# EAGLE design Calentador con PID (EAGLE 7.7.0)
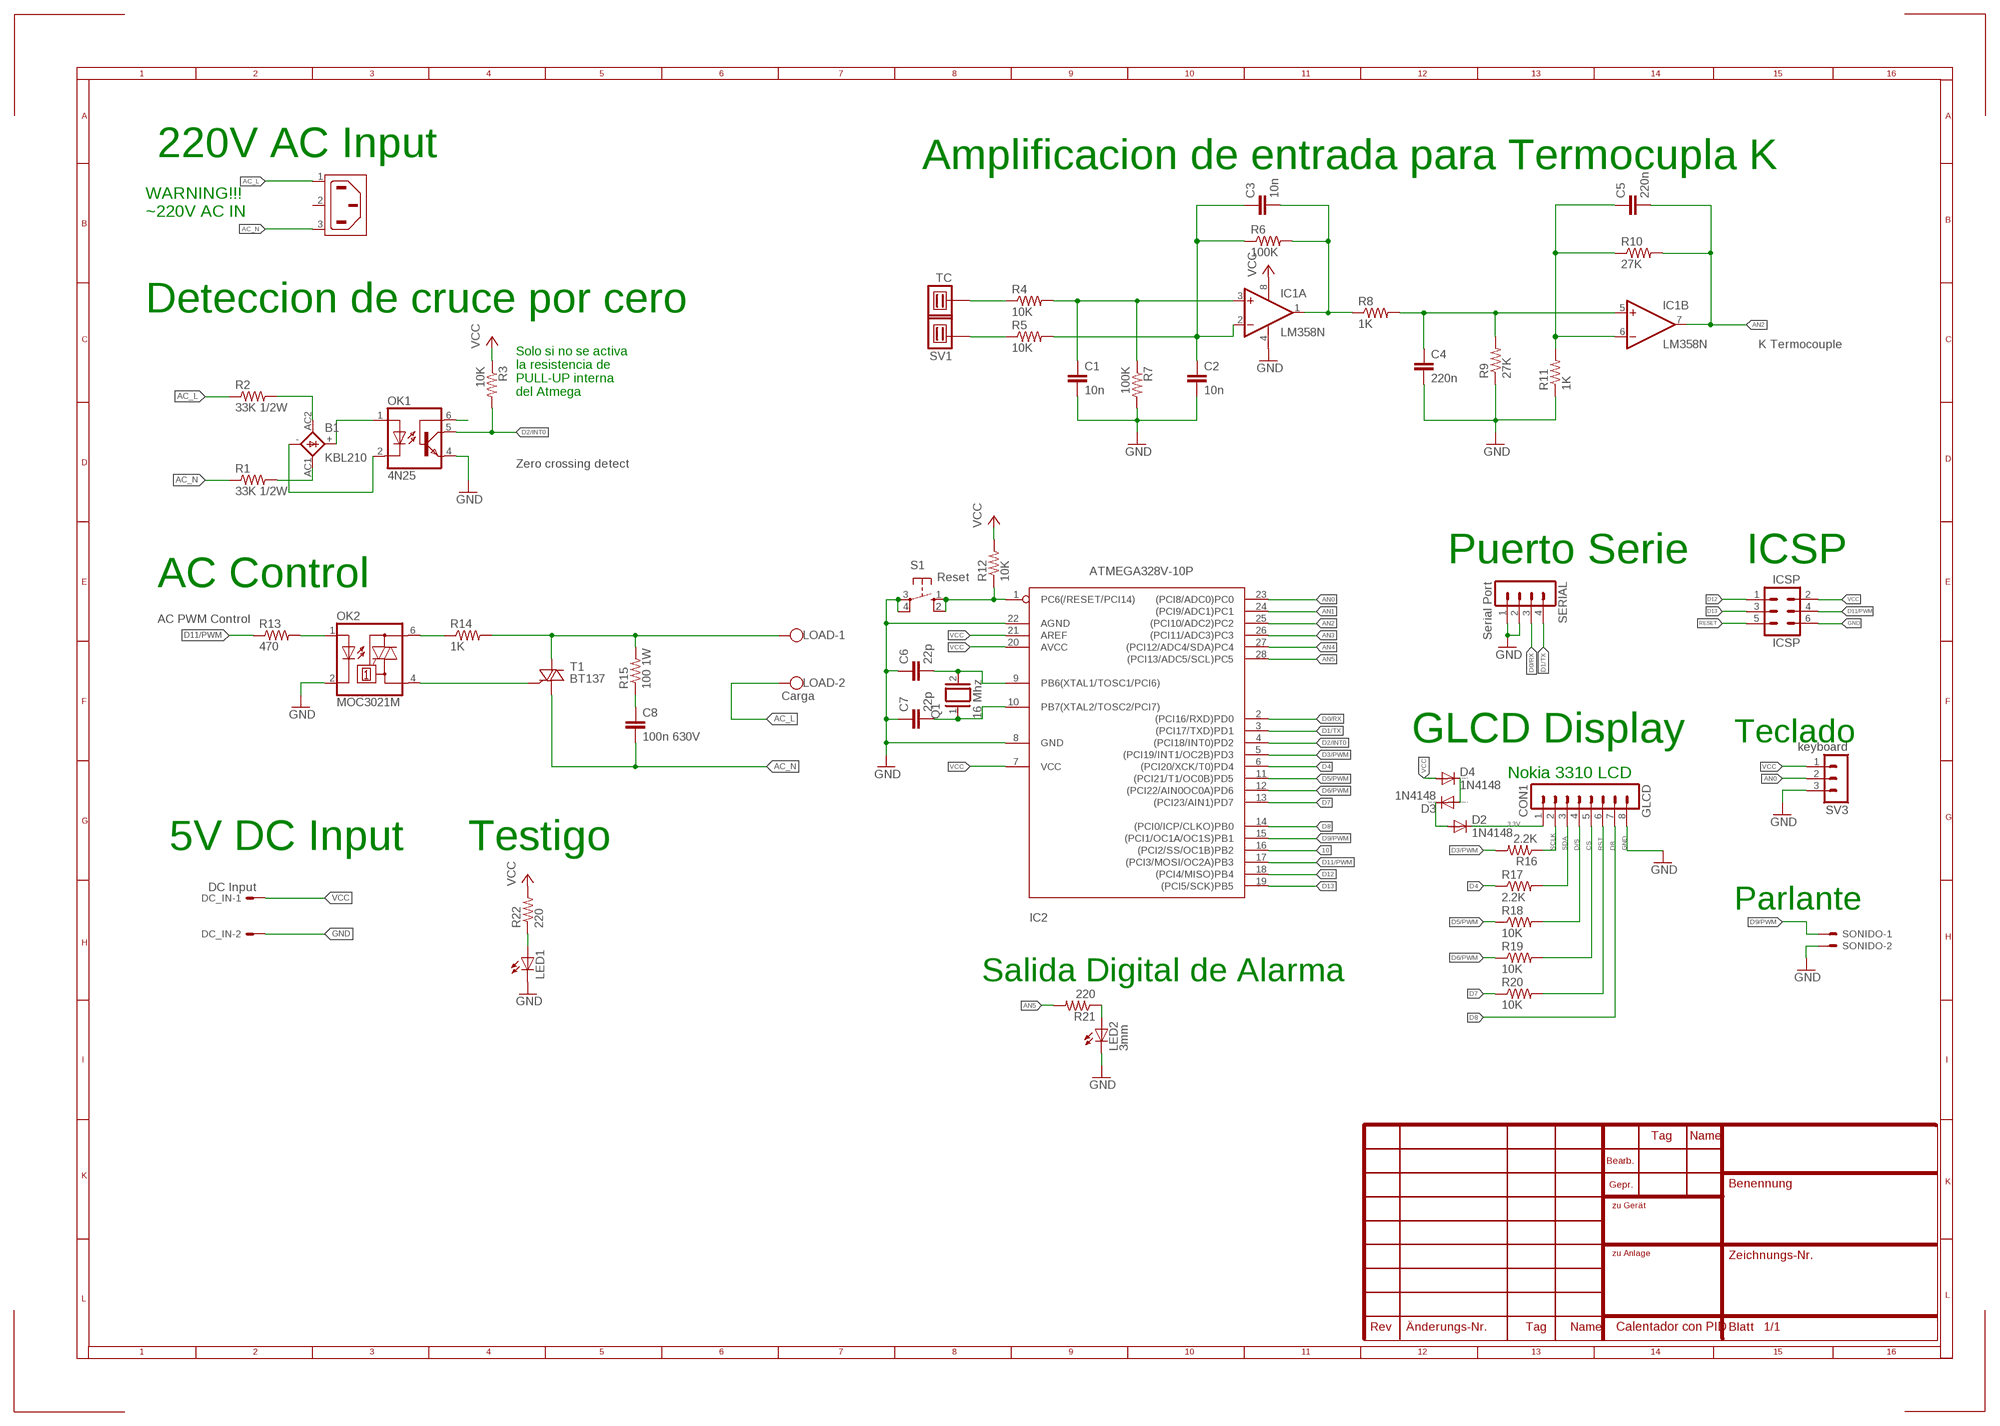
[diagram p0: schematic, sheet 1]

## Parts
B1  KBL210  KBL  [KBL]
C1  10n  C-EU050-024X044  [C050-024X044]
C2  10n  C-EU050-024X044  [C050-024X044]
C3  10n  C-EU050-024X044  [C050-024X044]
C4  220n  C-EU050-025X075  [C050-025X075]
C5  220n  C-EU050-025X075  [C050-025X075]
C6  22p  C-EU050-025X075  [C050-025X075]
C7  22p  C-EU050-025X075  [C050-025X075]
C8  100n 630V  C-EU102-043X133  [C102-043X133]
D2  1N4148  1N4148DO35-7  [DO35-7]
D3  1N4148  1N4148DO35-7  [DO35-7]
D4  1N4148  1N4148DO35-7  [DO35-7]
DC_IN  DC Input  22-23-2021  [22-23-2021]
GLCD  CON1  MA08-1  [MA08-1]
IC1  LM358N  [DIL08]
IC2  ATMEGA328V-10P  [DIL28-3]
ICSP  ICSP  MA03-2  [MA03-2]
LED1  LED3MM  [LED3MM]
LED2  3mm  LEDB155  [Q62902-B155]
LOAD  Carga  W237-102  [W237-102]
OK1  4N25  4N35  [DIL06]
OK2  MOC3021M  [DIL06]
Q1  16 Mhz  XTAL/S  [QS]
R1  33K 1/2W  R-US_0207/2V  [0207/2V]
R2  33K 1/2W  R-US_0207/2V  [0207/2V]
R3  10K  R-US_0207/7  [0207/7]
R4  10K  R-US_0207/7  [0207/7]
R5  10K  R-US_0207/7  [0207/7]
R6  100K  R-US_0207/2V  [0207/2V]
R7  100K  R-US_0207/7  [0207/7]
R8  1K  R-US_0207/2V  [0207/2V]
R9  27K  R-US_0207/7  [0207/7]
R10  27K  R-US_0207/2V  [0207/2V]
R11  1K  R-US_0207/7  [0207/7]
R12  10K  R-US_0207/15  [0207/15]
R13  470  R-US_0207/10  [0207/10]
R14  1K  R-US_0207/2V  [0207/2V]
R15  100 1W  R-US_0207/2V  [0207/2V]
R16  2.2K  R-US_0207/10  [0207/10]
R17  2.2K  R-US_0207/10  [0207/10]
R18  10K  R-US_0207/7  [0207/7]
R19  10K  R-US_0207/7  [0207/7]
R20  10K  R-US_0207/7  [0207/7]
R21  220  R-US_0207/7  [0207/7]
R22  220  R-US_0207/2V  [0207/2V]
S1  Reset  10-XX  [B3F-10XX]
SERIAL  Serial Port  MA04-1  [MA04-1]
SONIDO  22-23-2021  [22-23-2021]
SV1  TC  THERMOCOUPLE  [THERMOCOUPLE]
SV3  keyboard  MA03-1  [MA03-1]
T1  BT137  BT138-V  [TO220BV]
X1  6ESRM-P  [6ESRM-P]

## Nets
3.3V: D2.C GLCD.1
10: IC2.16((PCI2/SS/OC1B)PB2)
AC_L: LOAD.2 R2.1 X1.1(AC1)
AC_N: C8.2 R1.1 T1.T1(A1) X1.3(AC2)
AN0: IC2.23((PCI8/ADC0)PC0) SV3.2
AN1: IC2.24((PCI9/ADC1)PC1)
AN2: C5.2 IC1.7(B:OUT) IC2.25((PCI10/ADC2)PC2) R10.2
AN3: IC2.26((PCI11/ADC3)PC3)
AN4: IC2.27((PCI12/ADC4/SDA)PC4)
AN5: IC2.28((PCI13/ADC5/SCL)PC5) R21.2
CS: GLCD.5 R19.2
D0/RX: IC2.2((PCI16/RXD)PD0) SERIAL.3
D1/TX: IC2.3((PCI17/TXD)PD1) SERIAL.4
D2/INT0: IC2.4((PCI18/INT0)PD2) OK1.5(COL) R3.2
D3/PWM: IC2.5((PCI19/INT1/OC2B)PD3) R16.2
D4: IC2.6((PCI20/XCK/T0)PD4) R17.1
D5/PWM: IC2.11((PCI21/T1/OC0B)PD5) R18.1
D6/PWM: IC2.12((PCI22/AIN0OC0A)PD6) R19.1
D7: IC2.13((PCI23/AIN1)PD7) R20.1
D8: GLCD.7 IC2.14((PCI0/ICP/CLKO)PB0)
D9/PWM: IC2.15((PCI1/OC1A/OC1S)PB1) SONIDO.1
D11/PWM: IC2.17((PCI3/MOSI/OC2A)PB3) ICSP.4 R13.1
D12: IC2.18((PCI4/MISO)PB4) ICSP.1
D13: IC2.19((PCI5/SCK)PB5) ICSP.3
D/S: GLCD.4 R18.2
GND: C1.2 C2.2 C4.2 C6.1 C7.1 DC_IN.2 GLCD.8 IC1.4(P:V-) IC2.8(GND) IC2.22(AGND) ICSP.6 LED1.K(C) LED2.K(C) OK1.4(EMI) OK2.2(C) R7.2 R9.1 R11.1 S1.3(P) S1.4(P1) SERIAL.1 SERIAL.2 SONIDO.2 SV3.3
N$1: OK2.1(A) R13.2
N$2: OK2.6(A2) R14.1
N$3: B1.AC2(AC1) R2.2
N$4: B1.AC1(AC2) R1.2
N$5: B1.+ OK1.1(A)
N$6: B1.- OK1.2(C)
N$7: R4.1 SV1.2
N$8: C4.1 IC1.5(B:+IN) R8.2 R9.2
N$9: R5.1 SV1.1
N$10: C2.1 C3.1 IC1.2(A:-IN) R5.2 R6.1
N$11: C3.2 IC1.1(A:OUT) R6.2 R8.1
N$12: C5.1 IC1.6(B:-IN) R10.1 R11.2
N$13: C1.1 IC1.3(A:+IN) R4.2 R7.1
N$14: LOAD.1 R14.2 R15.2 T1.T2(A2)
N$15: OK2.4(A1) T1.G
N$16: C7.2 IC2.10(PB7(XTAL2/TOSC2/PCI7)) Q1.1
N$17: C6.2 IC2.9(PB6(XTAL1/TOSC1/PCI6)) Q1.2
N$19: D2.A D3.C
N$20: C8.1 R15.1
N$21: D3.A D4.C
N$23: LED2.A R21.1
N$24: LED1.A R22.1
N$27: OK1.6(BAS)
RESET: IC2.1(PC6(/RESET/PCI14)) ICSP.5 R12.1 S1.1(S) S1.2(S1)
RST: GLCD.6 R20.2
SCLK: GLCD.2 R16.1
SDA: GLCD.3 R17.2
VCC: D4.A DC_IN.1 IC1.8(P:V+) IC2.7(VCC) IC2.20(AVCC) IC2.21(AREF) ICSP.2 R3.1 R12.2 R22.2 SV3.1
Unconnected: X1.2(SH)

## Notes on the sheet
- 220V AC Input | Amplificacion de entrada para Termocupla K
- WARNING!!!
  ~220V AC IN
- Deteccion de cruce por cero
- K Termocouple
- Solo si no se activa
  la resistencia de
  PULL-UP interna
  del Atmega
- Zero crossing detect
- Puerto Serie | ICSP
- AC Control
- AC PWM Control
- GLCD Display | Teclado
- Nokia 3310 LCD
- 5V DC Input | Testigo
- Parlante
- Salida Digital de Alarma

## Library data of the parts
B1 = rectifier:KBL: DIOTEC RECTIFIER
C1-C8 = rcl2:C-EU: CAPACITOR, European symbol
D2-D4 = diode:1N4148: DIODE high speed (Philips)
DC_IN SONIDO = con-molex:22-23-2021: .100" (2.54mm) Center Header - 2 Pin; MF: MOLEX; MPN: 22-23-2021; OC_FARNELL: 1462926; OC_NEWARK: 25C3832
GLCD = con-lstb:MA08-1: PIN HEADER; OC_FARNELL: unknown; OC_NEWARK: unknown
IC1 = linear:LM358: OP AMP also LM158; LM258; LM2904 Source: http://cache.national.com/ds/LM/LM158.pdf
IC2 = atmega328:ATMEGA328*P: MICROCONTROLLER 32 kBytes FLASH 2 kBytes SRAM 1 kBytes EEPROM USART 8-channel 10 bit ADC
ICSP = con-lstb:MA03-2: PIN HEADER; OC_FARNELL: unknown; OC_NEWARK: unknown
LED1 LED2 = led:LED: LED OSRAM: - CHIPLED LG R971, LG N971, LY N971, LG Q971, LY Q971, LO R971, LY R971 LH N974, LH R974 LS Q976, LO Q976, LY Q976 LO Q996 - Hyper CHIPLED LW Q18S LB Q993, LB Q99A, LB R99A - SideLED LS A670, LO A670, LY A670, LG A670, LP A670 LB A673, LV A673, LT A673, LW A673 LH A674 LY A675 LS A676, LA A676, LO A676, LY A676, LW A676 LS A679, LY A679, LG A679 - Hyper Micro SIDELED® LS Y876, LA Y876, LO Y876, LY Y876 LT Y87S - SmartLED LW L88C, LW L88S LB L89C, LB L89S, LG L890 LS L89K, LO L89K, LY L89K LS L896, LA L896, LO L896, LY L896 - TOPLED LS T670, LO T670, LY T670, LG T670, LP T670 LSG T670, LSP T670, LSY T670, LOP T670, LYG T670 LG T671, LOG T671, LSG T671 LB T673, LV T673, LT T673, LW T673 LH T674 LS T676, LA T676, LO T676, LY T676, LB T676, LH T676, LSB T676, LW T676 LB T67C, LV T67C, LT T67C, LS T67K, LO T67K, LY T67K, LW E67C LS E67B, LA E67B, LO E67B, LY E67B, LB E67C, LV E67C, LT E67C LW T67C LS T679, LY T679, LG T679 LS T770, LO T770, LY T770, LG T770, LP T770 LB T773, LV T773, LT T773, LW T773 LH T774 LS E675, LA E675, LY E675, LS T675 LS T776, LA T776, LO T776, LY T776, LB T776 LHGB T686 LT T68C, LB T68C - Hyper Mini TOPLED® LB M676 - Mini TOPLED Santana® LG M470 LS M47K, LO M47K, LY M47K Source: http://www.osram.convergy.de LUXEON: - LUMILED® LXK2-PW12-R00, LXK2-PW12-S00, LXK2-PW14-U00, LXK2-PW14-V00 LXK2-PM12-R00, LXK2-PM12-S00, LXK2-PM14-U00 LXK2-PE12-Q00, LXK2-PE12-R00, LXK2-PE12-S00, LXK2-PE14-T00, LXK2-PE14-U00 LXK2-PB12-K00, LXK2-PB12-L00, LXK2-PB12-M00, LXK2-PB14-N00, LXK2-PB14-P00, LXK2-PB14-Q00 LXK2-PR12-L00, LXK2-PR12-M00, LXK2-PR14-Q00, LXK2-PR14-R00 LXK2-PD12-Q00, LXK2-PD12-R00, LXK2-PD12-S00 LXK2-PH12-R00, LXK2-PH12-S00 LXK2-PL12-P00, LXK2-PL12-Q00, LXK2-PL12-R00 Source: www.luxeon.com KINGBRIGHT: KA-3528ASYC Source: www.kingbright.com
LOAD = con-wago-500:W237-102: WAGO SCREW CLAMP; MPN: 237-102; OC_FARNELL: unknown; OC_NEWARK: 70K9898
OK1 = optocoupler:4N35: MOTOROLA OPTO COUPLER; MF: FAIRCHILD SEMICONDUCTOR; MPN: 4N35; OC_FARNELL: 1328375; OC_NEWARK: 72K9946
OK2 = optocoupler:MOC30*M: RANDOM-PHASE OPTOISOLATORS TRIAC DRIVER OUTPUT Source: http://www.fairchildsemi.com MOC3020-M.pdf; MF: FAIRCHILD SEMICONDUCTOR; MPN: MOC3021-M; OC_FARNELL: 1021365; OC_NEWARK: 95B7895
Q1 = special:XTAL/S: CRYSTAL
R1-R22 = rcl2:R-US_: RESISTOR, American symbol
S1 = switch-omron:10-XX: OMRON SWITCH; MPN: B3F-1000; OC_FARNELL: 176432; OC_NEWARK: 36M3542
SERIAL = con-lstb:MA04-1: PIN HEADER; OC_FARNELL: unknown; OC_NEWARK: unknown
SV1 = thermocouple:THERMOCOUPLE: PIN HEADER
SV3 = con-lstb:MA03-1: PIN HEADER; OC_FARNELL: unknown; OC_NEWARK: unknown
T1 = triac:BT138: TRIAC Source: http://www.semiconductors.philips.com BT138_SERIES_2.pdf
X1 = con-tycoelectronics:6ESRM-P: AC Connector 120/250 VAC Source: http://catalog.tycoelectronics.com .. ENG_DS_1654001_1099_SR_0406.pdf; MF: TYCO ELECTRONICS; MPN: 6ESRM-P; OC_FARNELL: unknown; OC_NEWARK: 87F1821

## Board
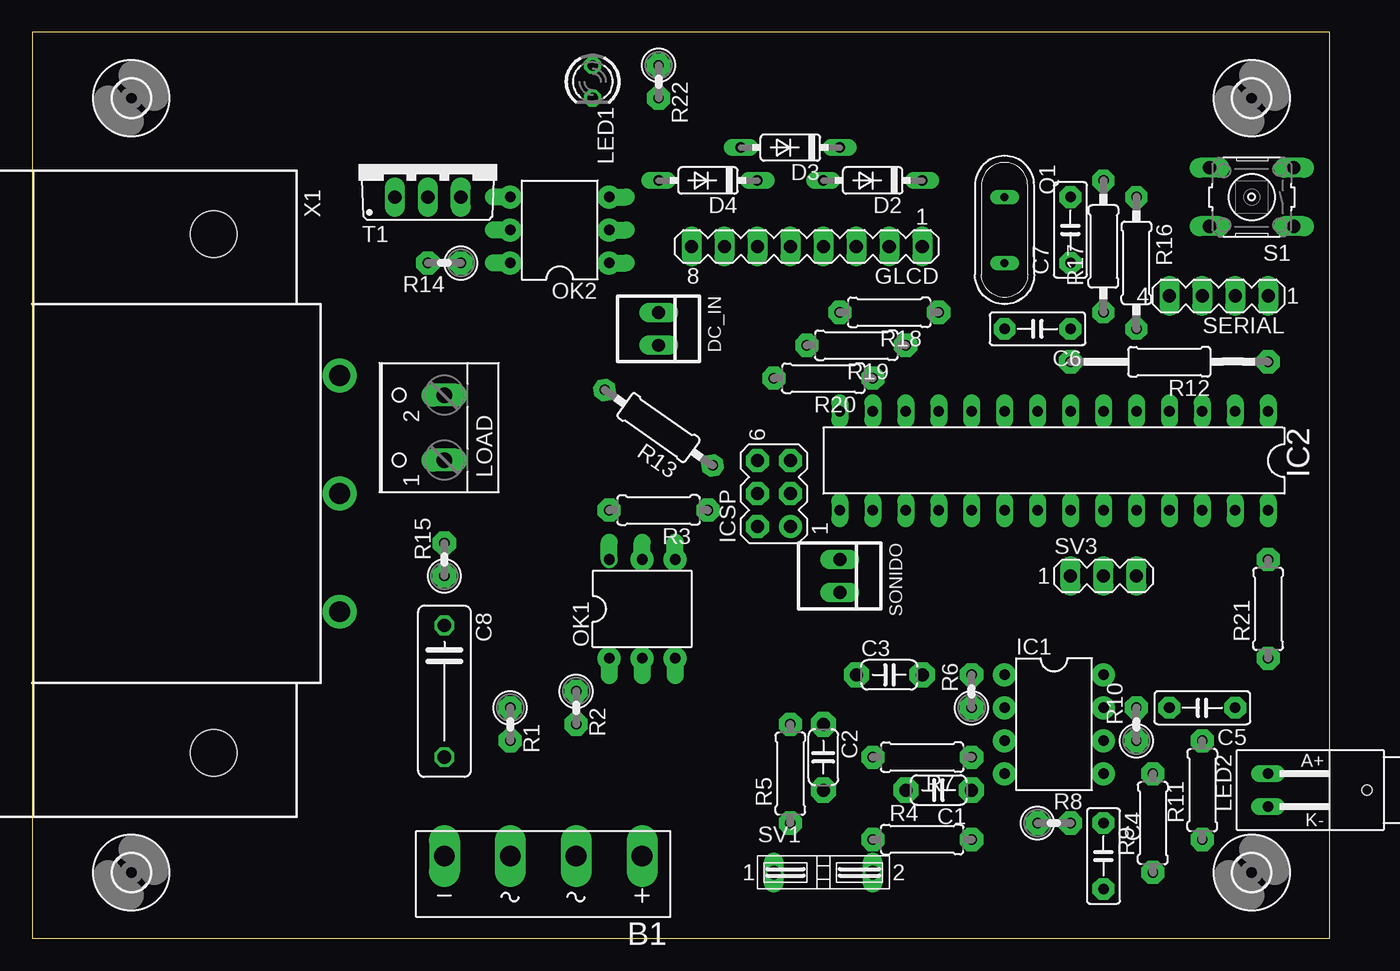
[diagram p1: board, top side]
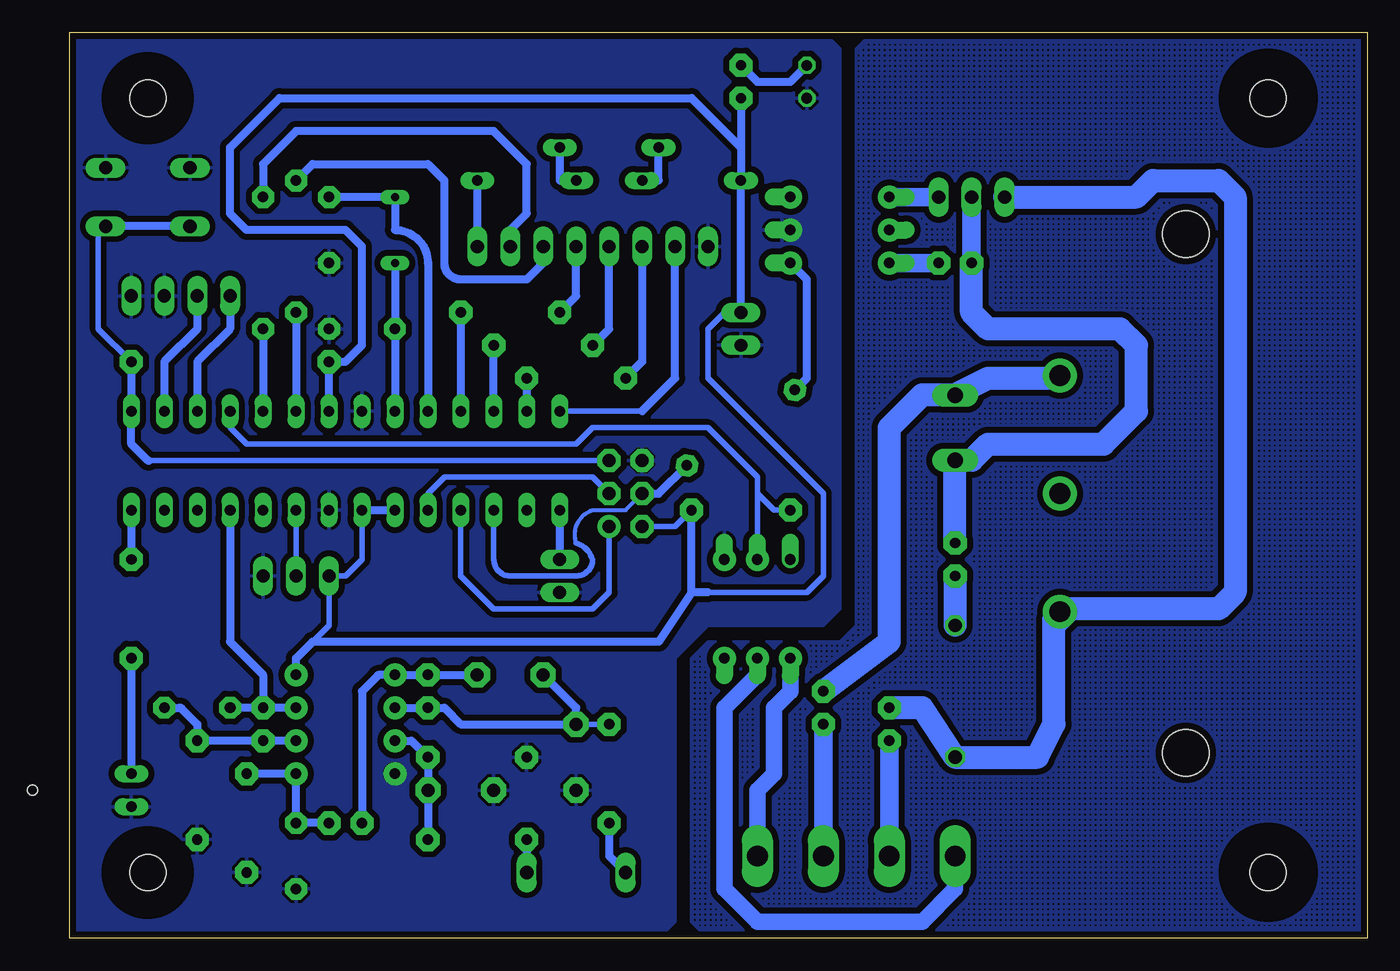
[diagram p2: board, bottom side, seen from below]

Size 100 x 69.84 mm. Coordinates in mm from the lower left corner, seen from the top.
Outline: 0,0 100,0 100,69.84 0,69.84 0,0
Copper layers (1*16): Top 0.035mm / dielectric 1.5mm / Bottom 0.035mm
Design rules "default *": minimum track width 10mil, minimum drill 24mil, track to track 18mil, track to pad 12mil, pad to pad 8mil, via to via 8mil, smd to smd 8mil, copper to edge 20mil, drill to drill 8mil, minimum pad ring 10mil, minimum via ring 8mil, stop-mask expansion 4mil, vias tented up to drill 0mil, thermal gap 10mil

### Footprints (pad centres in the part's own frame; a part is rotated, then mirrored left to right if it is on the bottom)
KBL = drill 1.6 long: + -7.62,-1.27; - 7.62,-1.27; AC1 2.54,-1.27; AC2 -2.54,-1.27
C050-024X044 = drill 1 pad 1.93 octagon: 1 -2.54,0; 2 2.54,0
C050-025X075 = drill 0.813 pad 1.676 octagon: 1 -2.54,0; 2 2.54,0
C102-043X133 = drill 1.016 octagon: 1 -5.08,0; 2 5.08,0
DO35-7 = drill 0.813 long: A 3.81,0; C -3.81,0
22-23-2021 = drill 1 long: 1 -1.27,0; 2 1.27,0
MA08-1 = drill 1.016 long: 1 -8.89,0; 2 -6.35,0; 3 -3.81,0; 4 -1.27,0; 5 1.27,0; 6 3.81,0; 7 6.35,0; 8 8.89,0
DIL08 = drill 0.813 pad 1.27: 1 -3.81,-3.81; 2 -1.27,-3.81; 3 1.27,-3.81; 4 3.81,-3.81; 5 3.81,3.81; 6 1.27,3.81; 7 -1.27,3.81; 8 -3.81,3.81
DIL28-3 = drill 0.813 long: 1 -16.51,-3.81; 2 -13.97,-3.81; 3 -11.43,-3.81; 4 -8.89,-3.81; 5 -6.35,-3.81; 6 -3.81,-3.81; 7 -1.27,-3.81; 8 1.27,-3.81; 9 3.81,-3.81; 10 6.35,-3.81; 11 8.89,-3.81; 12 11.43,-3.81; 13 13.97,-3.81; 14 16.51,-3.81; 15 16.51,3.81; 16 13.97,3.81; 17 11.43,3.81; 18 8.89,3.81; 19 6.35,3.81; 20 3.81,3.81; 21 1.27,3.81; 22 -1.27,3.81; 23 -3.81,3.81; 24 -6.35,3.81; 25 -8.89,3.81; 26 -11.43,3.81; 27 -13.97,3.81; 28 -16.51,3.81
MA03-2 = drill 1.016: 1 -2.54,-1.27 | drill 1.016 octagon: 2 -2.54,1.27; 3 0,-1.27; 4 0,1.27; 5 2.54,-1.27; 6 2.54,1.27
LED3MM = drill 0.813 octagon: A -1.27,0; K 1.27,0
Q62902-B155 = drill 0.813 long: A 7.62,-1.27; K 7.62,1.27 | hole 0.813: 0,0
W237-102 = drill 1.194 long: 1 -2.5,-1.27; 2 2.5,-1.27
DIL06 = drill 0.813 offset: 1 -2.54,-3.81; 2 0,-3.81; 3 2.54,-3.81; 4 2.54,3.81; 5 0,3.81; 6 -2.54,3.81
QS = drill 0.61 long: 1 -2.54,0; 2 2.54,0
0207/2V = drill 0.8 pad 1.778 octagon: 1 -1.27,0; 2 1.27,0
0207/7 = drill 0.8 pad 1.778 octagon: 1 -3.81,0; 2 3.81,0
0207/15 = drill 0.813 pad 1.778 octagon: 1 -7.62,0; 2 7.62,0
0207/10 = drill 0.813 pad 1.676 octagon: 1 -5.08,0; 2 5.08,0
B3F-10XX = drill 1.016 long: 1 -3.251,2.261; 2 3.251,2.261; 3 -3.251,-2.261; 4 3.251,-2.261
MA04-1 = drill 1.016 long: 1 -3.81,0; 2 -1.27,0; 3 1.27,0; 4 3.81,0
THERMOCOUPLE = drill 1.016 long: 1 -3.81,0; 2 3.81,0
MA03-1 = drill 1.016 long: 1 -2.54,0; 2 0,0; 3 2.54,0
TO220BV = drill 1.016 long: G 2.54,-2.54; T1 -2.54,-2.54; T2 0,-2.54
2,8 = hole 2.8: 0,0
6ESRM-P = drill 1.6 pad 2.6: 1 -9.1,9.7; 2 0,9.7; 3 9.1,9.7 | hole 3.6: -20,0; 20,0

### Placement (x,y rotation side)
B1  39.37,5.08 180 top
C1  69.85,11.43 180 top
C2  60.96,13.97 270 top
C3  66.04,20.32 0 top
C4  82.55,6.35 270 top
C5  90.17,17.78 180 top
C6  77.47,46.99 180 top
C7  80.01,54.61 90 top
C8  31.75,19.05 270 top
D2  64.77,58.42 180 top
D3  58.42,60.96 180 top
D4  52.07,58.42 180 top
DC_IN  48.26,46.99 270 top
GLCD  59.69,53.34 180 top
IC1  78.74,16.51 270 top
IC2  78.74,36.83 180 top
ICSP  57.15,34.29 90 top
LED1  43.18,66.04 270 top
LED2  102.87,11.43 180 top
LOAD  30.48,39.37 90 top
OK1  46.99,25.4 0 top
OK2  40.64,54.61 90 top
Q1  74.93,54.61 270 top
R1  36.83,16.51 270 top
R2  41.91,17.78 270 top
R3  48.26,33.02 180 top
R4  68.58,7.62 0 top
R5  58.42,12.7 90 top
R6  72.39,19.05 90 top
R7  68.58,13.97 180 top
R8  78.74,8.89 0 top
R9  86.36,8.89 90 top
R10  85.09,16.51 90 top
R11  90.17,11.43 90 top
R12  87.63,44.45 180 top
R13  48.26,39.37 145 top
R14  31.75,52.07 180 top
R15  31.75,29.21 90 top
R16  85.09,52.07 270 top
R17  82.55,53.34 90 top
R18  66.04,48.26 180 top
R19  63.5,45.72 180 top
R20  60.96,43.18 180 top
R21  95.25,25.4 90 top
R22  48.26,66.04 270 top
S1  93.98,57.15 180 top
SERIAL  91.44,49.53 180 top
SONIDO  62.23,27.94 270 top
SV1  60.96,5.08 0 top
SV3  82.55,27.94 0 top
T1  30.48,59.69 0 top
U$1  [2,8]  93.98,64.77 0 top
U$2  [2,8]  93.98,5.08 0 top
U$3  [2,8]  7.62,5.08 0 top
U$4  [2,8]  7.62,64.77 0 top
X1  13.97,34.29 270 top

### Tracks (layer width: path | path; a pad name or v marks a point on that pad's centre or on a via)
3.3V
  Bottom 0.61: D2.C GLCD.1
AC_L
  Bottom 1.778: R2.1 36.83,22.86 36.83,39.37 34.29,41.91 31.79,41.91 LOAD.2 31.75,41.91 29.21,43.18 23.88,43.18 X1.1
AC_N
  Bottom 1.778: 24.13,24.13 24.13,16.51 25.4,13.97 C8.2 34.29,17.78 R1.1 | 24.13,24.13 24.13,24.73 X1.3 | T1.T1 17.78,57.15 16.51,58.42 11.43,58.42 10.16,57.15 10.16,26.67 11.43,25.4 22.86,25.4 24.13,24.13
AN0
  Bottom 0.406: SV3.2 IC2.23
AN2  (via drill 0.8 pad 1.78)
  Bottom 0.61: IC1.7 R10.2 | R10.2 C5.2 | IC2.25 87.63,22.86 85.09,20.32 R10.2
  other vias: 82.55,17.78
AN5
  Bottom 0.61: IC2.28 R21.2
CS
  Bottom 0.61: R19.2 58.42,46.99 GLCD.5
D0/RX
  Bottom 0.61: SERIAL.3 90.17,46.99 92.71,44.45 IC2.2
D1/TX
  Bottom 0.61: SERIAL.4 87.63,46.99 90.17,44.45 IC2.3
D2/INT0  (via drill 0.8 pad 1.78)
  Bottom 0.406: IC2.4 87.63,39.37 86.36,38.1 60.96,38.1 59.69,39.37 50.8,39.37 46.99,35.56 46.99,34.29 | OK1.5 46.99,34.29 | R3.2 45.72,33.02 46.99,34.29
  other vias: 46.99,29.21
D3/PWM
  Bottom 0.61: R16.2 IC2.5
D4
  Bottom 0.61: R17.1 IC2.6
D5/PWM
  Bottom 0.61: R18.1 IC2.11
D6/PWM
  Bottom 0.61: IC2.12 R19.1
D7
  Bottom 0.61: R20.1 IC2.13
D8
  Bottom 0.406: IC2.14 55.88,40.64
  Bottom 0.61: GLCD.7 53.34,43.18 55.88,40.64
D9/PWM
  Bottom 0.61: IC2.15 SONIDO.1
D11/PWM  (via drill 0.8 pad 1.78)
  Bottom 0.305: 60.96,30.48 arc90 59.69,33.02 57.15,33.02 ICSP.4
  Bottom 0.406: IC2.17 67.31,29.21 arc-90 66.04,27.94 60.96,27.94 arc-90 59.69,29.21 arc-53 60.96,30.48
  Bottom 0.61: ICSP.4 54.61,34.29 R13.1
  other vias: 55.88,34.29
D12  (via drill 0.8 pad 1.78)
  Bottom 0.406: IC2.18 69.85,27.94 67.31,25.4 59.69,25.4 58.42,26.67 ICSP.1
  other vias: 58.42,31.75
D13  (via drill 0.8 pad 1.78)
  Bottom 0.406: IC2.19 72.39,34.29 71.12,35.56 59.69,35.56 ICSP.3
  other vias: 58.42,34.29
D/S
  Bottom 0.61: R18.2 60.96,49.53 GLCD.4
GND  (via drill 0.8 pad 1.78)
  other vias: 55.88,36.83 74.93,12.7 44.45,54.61
  pour Bottom: 41.91,69.85 100.33,69.85 100.33,0 54.61,0 53.34,1.27 53.34,21.59 50.8,24.13 41.91,24.13 40.64,25.4 40.64,68.58
N$1  (via drill 0.8 pad 1.78)
  Bottom 0.61: R13.2 44.3,42.06 43.18,43.18 43.18,50.8 OK2.1
  other vias: 44.45,52.07
N$2  (via drill 0.8 pad 1.78)
  Bottom 1.422: OK2.6 R14.1
  other vias: 36.83,52.07
N$3
  Bottom 1.422: B1.AC2 R2.2
N$4
  Bottom 1.422: B1.AC1 R1.2
N$5  (via drill 0.8 pad 1.78)
  Bottom 1.27: OK1.1 44.45,19.05 45.72,17.78 45.72,12.7 46.99,11.43 B1.+
  other vias: 44.45,21.59
N$6  (via drill 0.8 pad 1.78)
  Bottom 1.27: B1.- 31.75,3.81 34.29,1.27 46.99,1.27 49.53,3.81 49.53,17.78 46.99,20.32 OK1.2
  other vias: 46.99,21.59
N$7
  Bottom 0.61: R4.1 SV1.2
N$8  (via drill 0.8 pad 1.78)
  Bottom 0.61: R8.2 C4.1 IC1.5 R9.2
  other vias: 82.55,12.7
N$9
  Bottom 0.61: R5.1 58.42,6.35 SV1.1
N$10  (via drill 0.8 pad 1.78)
  Bottom 0.406: R5.2 C2.1
  Bottom 0.61: IC1.2 R6.1 71.12,17.78 69.85,16.51 C2.1 60.96,17.78 C3.1
  other vias: 74.93,17.78
N$11  (via drill 0.8 pad 1.78)
  Bottom 0.406: IC1.1 76.2,20.32 77.47,19.05
  Bottom 0.61: R8.1 77.47,19.05 76.27,20.25 arc45 76.09,20.32 IC1.1 R6.2 C3.2
  other vias: 74.93,20.32
N$12  (via drill 0.8 pad 1.78)
  Bottom 0.61: IC1.6 R10.1 R11.2 90.17,16.51 91.37,17.71 arc-45 91.55,17.78 C5.1
  other vias: 82.55,15.24
N$13  (via drill 0.8 pad 1.78)
  Bottom 0.406: R7.1 R4.2
  Bottom 0.61: R4.2 C1.1 R7.1 73.66,15.24 IC1.3
  other vias: 74.93,15.24
N$14
  Bottom 1.422: T1.T2 R14.2
  Bottom 1.778: R15.2 LOAD.1 30.44,36.87 29.21,38.1 20.32,38.1 17.78,40.64 17.78,45.72 19.05,46.99 29.21,46.99 30.48,48.26 R14.2
N$15  (via drill 0.8 pad 1.78)
  Bottom 1.422: OK2.4 T1.G
  other vias: 36.83,57.15
N$16
  Bottom 0.61: C7.2 Q1.1 74.93,54.61 arc90 72.39,52.07 IC2.10
N$17
  Bottom 0.61: IC2.9 C6.2 Q1.2
N$18
  pour Bottom (isolate 0.254, hatched): 0,69.85 38.1,69.85 39.37,68.58 39.37,24.13 40.64,22.86 50.8,22.86 52.07,21.59 52.07,1.27 50.8,0 0,0
N$19
  Bottom 0.61: D3.C 62.23,58.42 D2.A
N$20
  Bottom 1.778: R15.1 C8.1
N$21
  Bottom 0.61: D4.C 54.61,58.42 D3.A
N$22  (via drill 0.8 pad 1.78)
  other vias: 49.53,29.21
N$23
  Bottom 0.61: R21.1 LED2.A
N$24
  Bottom 0.61: R22.1 46.99,66.04 44.45,66.04 LED1.A
N$25  (via drill 0.8 pad 1.78)
  other vias: 49.53,21.59
N$26  (via drill 0.8 pad 1.78)
  other vias: 44.45,57.15
N$28  (via drill 0.8 pad 1.78)
  other vias: 36.83,54.61
RESET  (via drill 0.8 pad 1.78)
  Bottom 0.406: ICSP.5 93.88,36.83 | R12.1 97.79,46.99 97.79,54.33 S1.1
  Bottom 0.61: R12.1 IC2.1 95.25,38.1 94.05,36.9 arc-45 93.88,36.83 | S1.2 S1.1
  other vias: 58.42,36.83
RST
  Bottom 0.61: GLCD.6 55.88,44.45 R20.2
SCLK
  Bottom 0.61: GLCD.2 66.04,54.61 64.77,55.88 64.77,59.69 67.31,62.23 82.55,62.23 85.09,59.69 R16.1
SDA
  Bottom 0.61: GLCD.3 63.5,52.07 64.77,50.8 69.85,50.8 arc90 71.12,52.07 71.12,58.42 72.39,59.69 81.28,59.69 R17.2
VCC  (via drill 0.8 pad 1.78)
  Bottom 0.406: 50.8,26.67 43.18,26.67 41.91,27.94 41.91,34.29 50.8,43.18 50.8,46.99 49.53,48.26 DC_IN.1 46.99,48.26 | ICSP.2 53.34,31.75 R3.1 | 81.28,22.86 80.01,24.13 SV3.1 78.74,27.94 77.47,29.21 IC2.21
  Bottom 0.61: 48.26,60.96 52.07,64.77 83.82,64.77 87.63,60.96 87.63,55.88 86.36,54.61 78.74,54.61 77.47,53.34 77.47,45.72 78.74,44.45 R12.2 IC2.7 | 48.26,60.96 D4.A DC_IN.1 | IC2.21 IC2.20 | 50.8,26.67 52.07,26.67 | 52.07,26.67 54.61,22.86 81.28,22.86 82.55,21.59 IC1.8 | 52.07,26.67 R3.1 | R22.2 48.26,60.96
  other vias: 55.88,31.75 82.55,20.32